# EAGLE design Untitled (EAGLE 7.1.0)
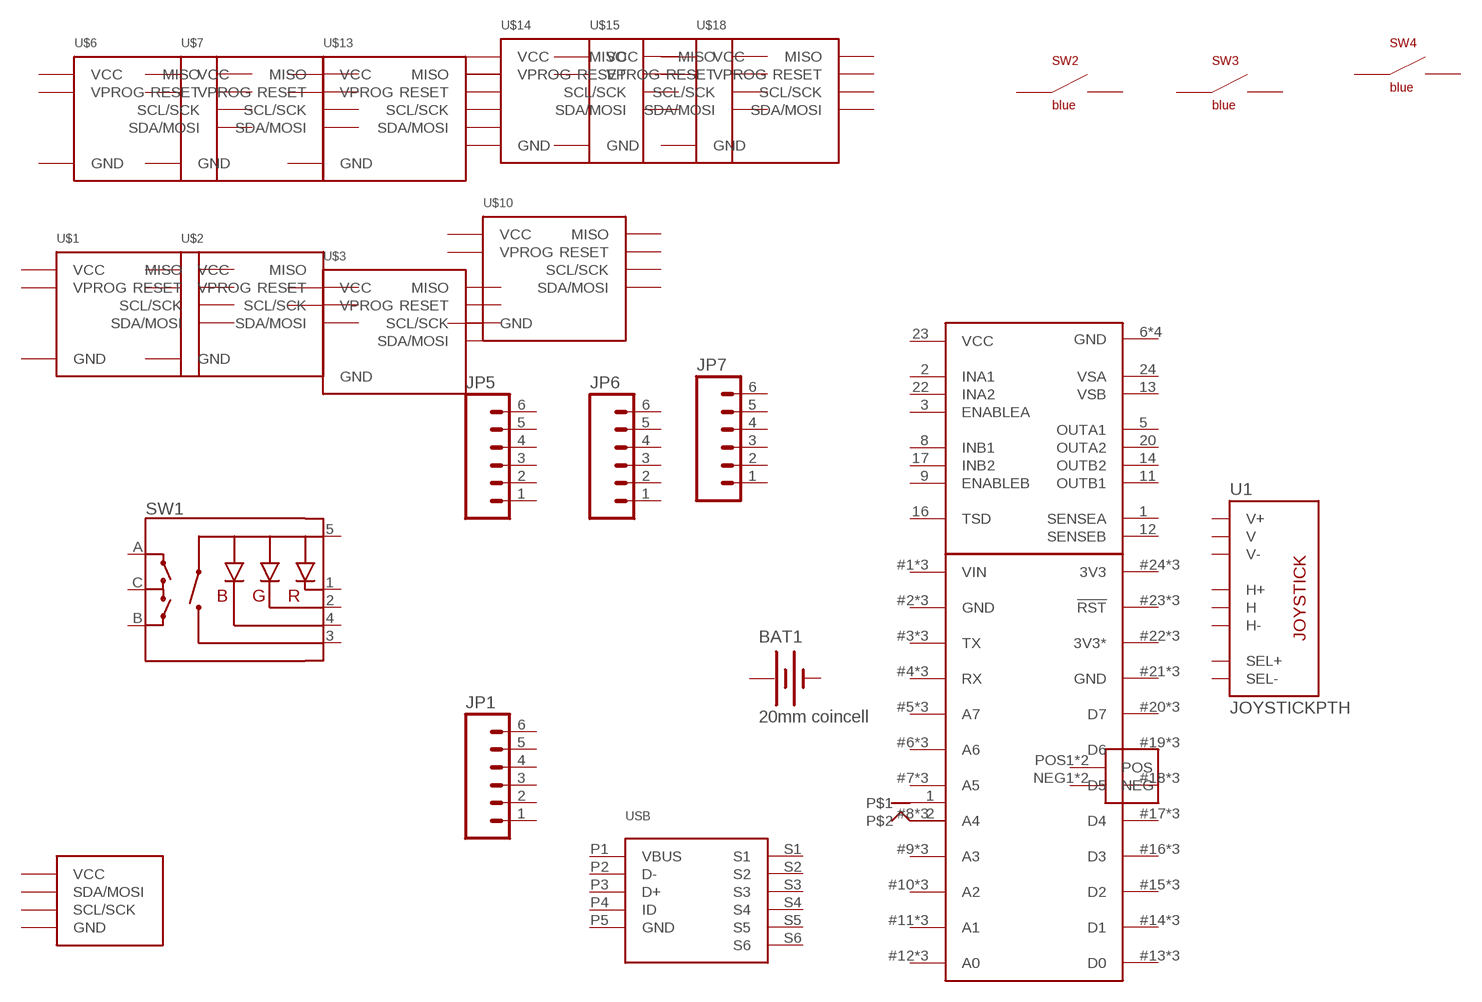
[diagram p0: schematic, sheet 1]

## Parts
BAT1  20mm coincell  BATTERY20MM_4LEGS  [BATTCON_20MM_4LEGS]
JP1  M06SIP  [1X06]
JP5  M06SIP  [1X06]
JP6  M06SIP  [1X06]
JP7  M06SIP  [1X06]
SW1  ENCODER_RGB_CA  [ENCODER_LED_3]
SW2  blue  SWITCHBOURNS-7914J  [BOURNS-7914J]
SW3  blue  SWITCHBOURNS-7914J  [BOURNS-7914J]
SW4  blue  SWITCHBOURNS-7914J  [BOURNS-7914J]
U1  JOYSTICKPTH  [JOYSTICK]
U$1  MAGDEVICE-V2  [MAGDEVICE-V2]
U$2  MAGDEVICE-V2  [MAGDEVICE-V2]
U$3  MAGDEVICE-V2  [MAGDEVICE-V2]
U$4  SPARK_CORE  [SPARK_CORE_STACKABLE]
U$5  DC-JACKLOWPRO  [DC-POWER-JACK-LOWPRO]
U$6  MAGDEVICE-V2  [MAGDEVICE-V2]
U$7  MAGDEVICE-V2  [MAGDEVICE-V2]
U$8  NJM2670  [SOP-24-E3]
U$9  THERMOCOUPLE-JACK  [THERMOCOUPLE-JACK]
U$10  MAGDEVICE-V2  [MAGDEVICE-V2]
U$11  MAGBASE  [MAGBASE]
U$13  MAGDEVICE-V2  [MAGDEVICE-V2]
U$14  MAGDEVICE-V2  [MAGDEVICE-V2]
U$15  MAGDEVICE-V2  [MAGDEVICE-V2]
U$16  USBFCI-MICROB  [USB-MICROB-FCI]
U$18  MAGDEVICE-V2  [MAGDEVICE-V2]
Unconnected: JP1.1 JP1.2 JP1.3 JP1.4 JP1.5 JP1.6 JP5.1 JP5.2 JP5.3 JP5.4 JP5.5 JP5.6 JP6.1 JP6.2 JP6.3 JP6.4 JP6.5 JP6.6 JP7.1 JP7.2 JP7.3 JP7.4 JP7.5 JP7.6 SW1.1(-R) SW1.2(-G) SW1.3(SW) SW1.4(-B) SW1.5(+) SW1.A SW1.B SW1.C SW2.NEG$1(NEG1) SW2.NEG$2(NEG1) SW2.POS$1(POS1) SW2.POS$2(POS1) SW3.NEG$1(NEG1) SW3.NEG$2(NEG1) SW3.POS$1(POS1) SW3.POS$2(POS1) SW4.NEG$1(NEG1) SW4.NEG$2(NEG1) SW4.POS$1(POS1) SW4.POS$2(POS1) U1.B1A(SEL+) U1.B2A(SEL-) U1.H1(H+) U1.H2(H) U1.H3(H-) U1.V1(V+) U1.V2(V) U1.V3(V-) U$1.GND(SDA/MOSI) U$1.MISO U$1.RESET U$1.SCL(GND) U$1.SDA(SCL/SCK) U$1.VCC U$1.VPROG U$2.GND(SDA/MOSI) U$2.MISO U$2.RESET U$2.SCL(GND) U$2.SDA(SCL/SCK) U$2.VCC U$2.VPROG U$3.GND(SDA/MOSI) U$3.MISO U$3.RESET U$3.SCL(GND) U$3.SDA(SCL/SCK) U$3.VCC U$3.VPROG U$4.3(TX) U$4.4(RX) U$4.5(A7) U$4.6(A6) U$4.7(A5) U$4.8(A4) U$4.9(A3) U$4.10(A2) U$4.11(A1) U$4.12(A0) U$4.13(D0) U$4.14(D1) U$4.15(D2) U$4.16(D3) U$4.17(D4) U$4.18(D5) U$4.19(D6) U$4.20(D7) U$4.23(!RST) U$4.#3(TX) U$4.#4(RX) U$4.#5(A7) U$4.#6(A6) U$4.#7(A5) U$4.#8(A4) U$4.#9(A3) U$4.#10(A2) U$4.#11(A1) U$4.#12(A0) U$4.#13(D0) U$4.#14(D1) U$4.#15(D2) U$4.#16(D3) U$4.#17(D4) U$4.#18(D5) U$4.#19(D6) U$4.#20(D7) U$4.#23(!RST) U$4.@3(TX) U$4.@4(RX) U$4.@5(A7) U$4.@6(A6) U$4.@7(A5) U$4.@8(A4) U$4.@9(A3) U$4.@10(A2) U$4.@11(A1) U$4.@12(A0) U$4.@13(D0) U$4.@14(D1) U$4.@15(D2) U$4.@16(D3) U$4.@17(D4) U$4.@18(D5) U$4.@19(D6) U$4.@20(D7) U$4.@23(!RST) U$5.1 U$5.2 U$6.GND(SDA/MOSI) U$6.MISO U$6.RESET U$6.SCL(GND) U$6.SDA(SCL/SCK) U$6.VCC U$6.VPROG U$7.GND(SDA/MOSI) U$7.MISO U$7.RESET U$7.SCL(GND) U$7.SDA(SCL/SCK) U$7.VCC U$7.VPROG U$8.1(SENSEA) U$8.2(INA1) U$8.3(ENABLEA) U$8.5(OUTA1) U$8.6(GND) U$8.7(GND) U$8.8(INB1) U$8.9(ENABLEB) U$8.11(OUTB1) U$8.12(SENSEB) U$8.13(VSB) U$8.14(OUTB2) U$8.16(TSD) U$8.17(INB2) U$8.18(GND) U$8.19(GND) U$8.20(OUTA2) U$8.22(INA2) U$8.23(VCC) U$8.24(VSA) U$9.NEG1(NEG) U$9.NEG2(NEG) U$9.POS1(POS) U$9.POS2(POS) U$10.GND(SDA/MOSI) U$10.MISO U$10.RESET U$10.SCL(GND) U$10.SDA(SCL/SCK) U$10.VCC U$10.VPROG U$11.GNDA(GND) U$11.GNDB(GND) U$11.SCLA(SCL/SCK) U$11.SCLB(SCL/SCK) U$11.SDAA(SDA/MOSI) U$11.SDAB(SDA/MOSI) U$11.VCCA(VCC) U$11.VCCB(VCC) U$13.GND(SDA/MOSI) U$13.MISO U$13.RESET U$13.SCL(GND) U$13.SDA(SCL/SCK) U$13.VCC U$13.VPROG U$14.GND(SDA/MOSI) U$14.MISO U$14.RESET U$14.SCL(GND) U$14.SDA(SCL/SCK) U$14.VCC U$14.VPROG U$15.GND(SDA/MOSI) U$15.MISO U$15.RESET U$15.SCL(GND) U$15.SDA(SCL/SCK) U$15.VCC U$15.VPROG U$16.P1(VBUS) U$16.P2(D-) U$16.P3(D+) U$16.P4(ID) U$16.P5(GND) U$16.S1 U$16.S2 U$16.S3 U$16.S4 U$16.S5 U$16.S6 U$18.GND(SDA/MOSI) U$18.MISO U$18.RESET U$18.SCL(GND) U$18.SDA(SCL/SCK) U$18.VCC U$18.VPROG

## Power pins joined to a net without a drawn wire
3V3: U$4.24(3V3) U$4.#24(3V3) U$4.@24(3V3)
3V3*: U$4.22(3V3*) U$4.#22(3V3*) U$4.@22(3V3*)
+: BAT1.1(+)
-: BAT1.2(-)
GND: U$4.2(GND) U$4.21(GND) U$4.#2(GND) U$4.#21(GND) U$4.@2(GND) U$4.@21(GND)
VIN: U$4.1(VIN) U$4.#1(VIN) U$4.@1(VIN)

## Library data of the parts
BAT1 = SparkFun-Electromechanical:BATTERY: Battery Holders Various common sizes : AA, AAA, 20mm coin cell and 12mm coin cell. 20MM_4LEGS, BATT-10373; PROD_ID: BATT-10373
JP1 JP5-JP7 = SparkFun-Connectors:M06: Header 6 Standard 6-pin 0.1" header. Use with straight break away headers (SKU : PRT-00116), right angle break away headers (PRT-00553), swiss pins (PRT-00743), machine pins (PRT-00117), and female headers (PRT-00115). Molex polarized connector foot print use with SKU : PRT-08094 with associated crimp pins and housings. NOTES ON THE VARIANTS LOCK and LOCK_LONGPADS... This footprint was designed to help hold the alignment of a through-hole component (i.e. 6-pin header) while soldering it into place. You may notice that each hole has been shifted either up or down by 0.005 of an inch from it's more standard position (which is a perfectly straight line). This slight alteration caused the pins (the squares in the middle) to touch the edges of the holes. Because they are alternating, it causes a "brace" to hold the component in place. 0.005 has proven to be the perfect amount of "off-center" position when using our standard breakaway headers. Although looks a little odd when you look at the bare footprint, once you have a header in there, the alteration is very hard to notice. Also,if you push a header all the way into place, it is covered up entirely on the bottom side. This idea of altering the position of holes to aid alignment will be further integrated into the Sparkfun Library for other footprints. It can help hold any component with 3 or more connection pins.
SW1 = SparkFun-Electromechanical:ENCODER_RGB_CA: Illuminated Rotary Encoder w/ RGB LED and select switch EC12PLRGBSDVBF-D: http://top-up.so-buy.com/front/bin/ptdetail.phtml?Part=EC12PLRGBSDVBF-D
SW2-SW4 = Modulo:SWITCH; PARTNUM: 7914J-1-000E
U1 = IntegerLabs:JOYSTICK: Thumb Joystick Joystick commonly found in PS2 controllers. Two pots and a select switch. Footprint proven. Spark Fun Electronics SKU : COM-09032
U$1-U$3 U$6 U$7 U$10 U$13-U$15 U$18 = Modulo:MAGDEVICE
U$4 = Spark:SPARK_CORE
U$5 = IntegerLabs:DC-JACK
U$8 = IntegerLabs:NJM2670
U$9 = IntegerLabs:THERMOCOUPLE-JACK
U$11 = Modulo:MAGBASE; PARTNUM: EXCLUDE
U$16 = IntegerLabs:USB

## Board
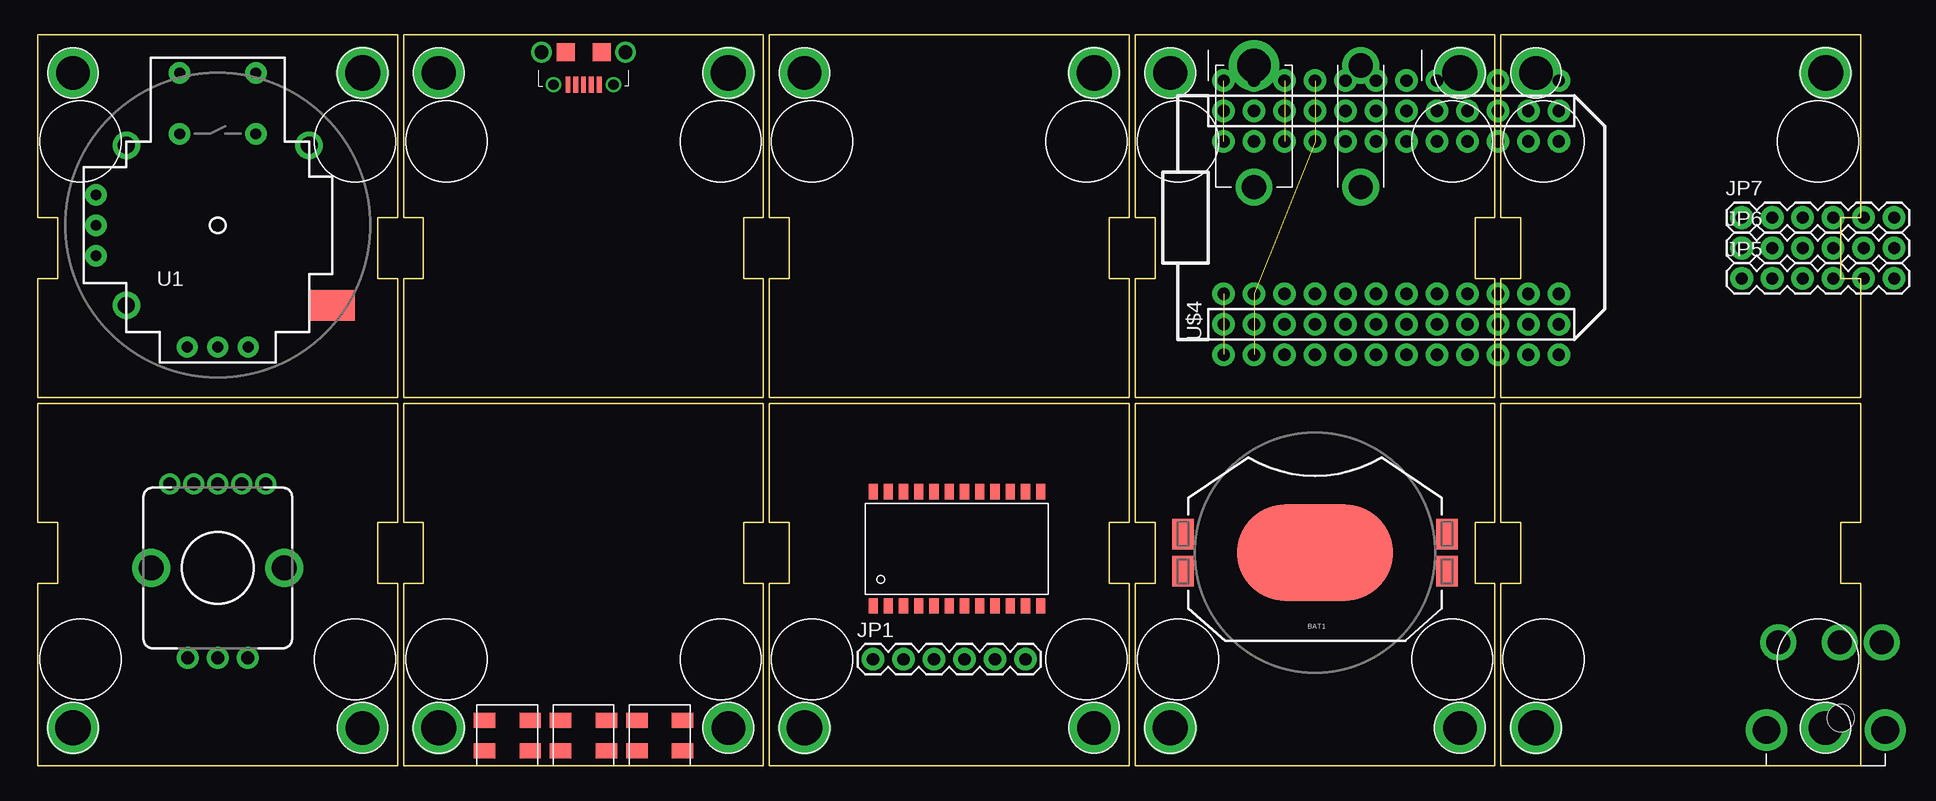
[diagram p1: board, top side]
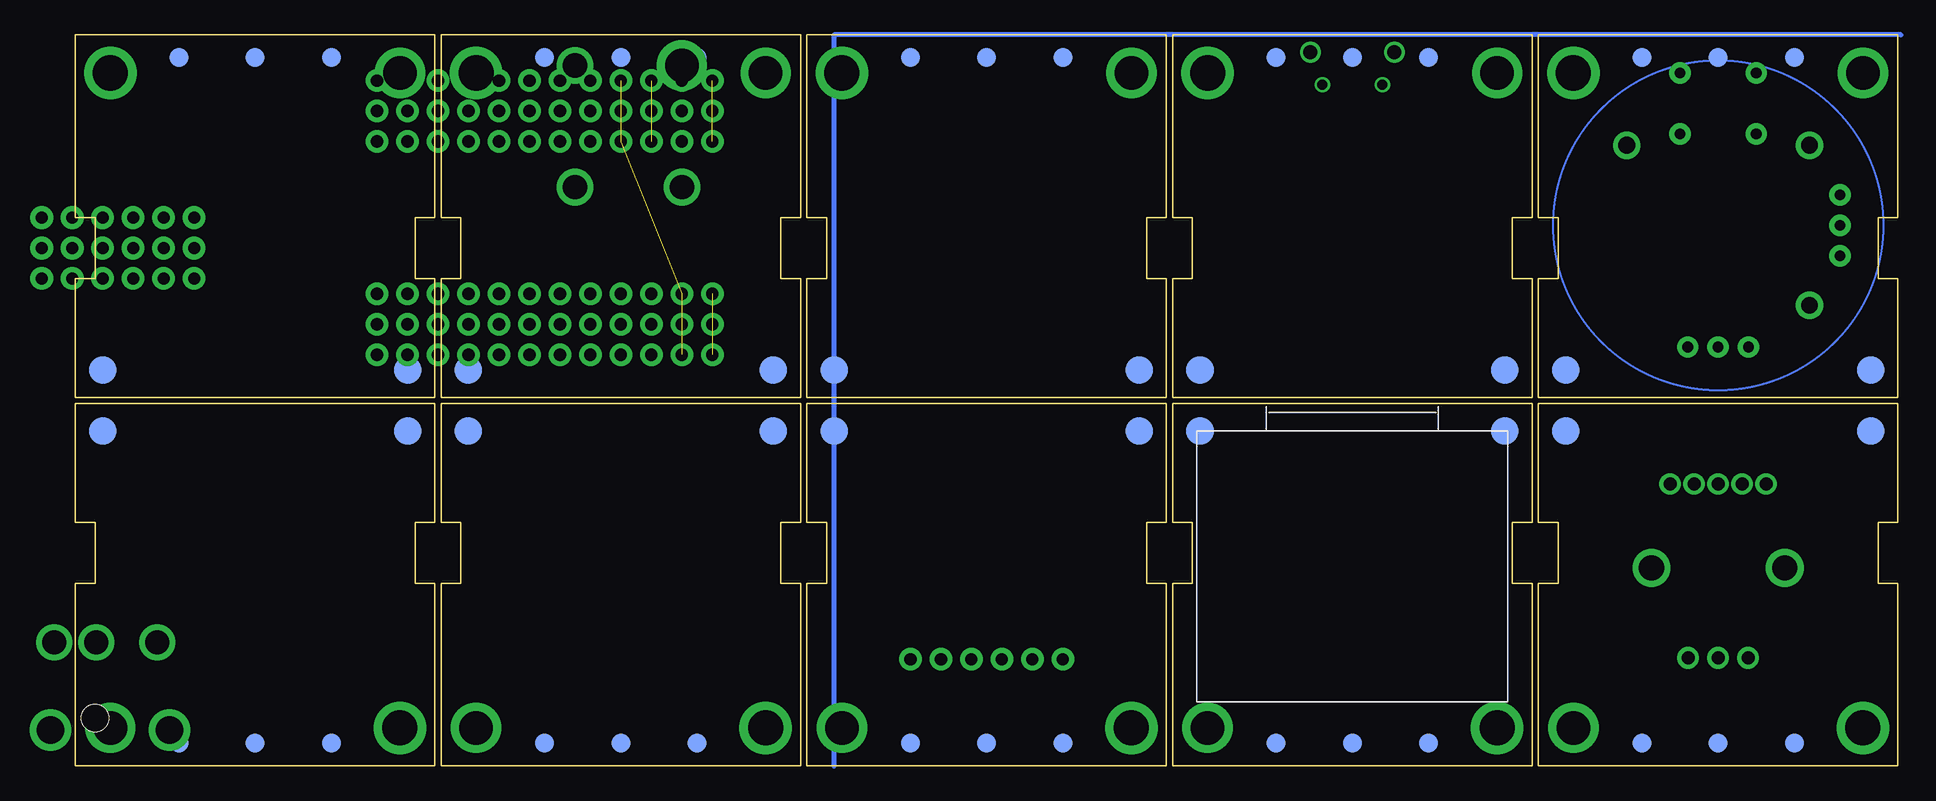
[diagram p2: board, bottom side, seen from below]

Size 151.89 x 60.96 mm. Coordinates in mm from the lower left corner, seen from the top.
Copper layers (1*16): Top 0.0178mm / dielectric 59mil / Bottom 0.0178mm
Design rules "SSC-EAGLE-2Lyr_v1.0.0.3": minimum track width 6mil, minimum drill 14mil, track to track 6mil, track to pad 6mil, pad to pad 6mil, via to via 6mil, smd to smd 6mil, copper to edge 20mil, drill to drill 16mil, minimum pad ring 8mil, minimum via ring 8mil, stop-mask expansion 3mil, vias tented up to drill 0mil, thermal gap 10mil

### Footprints (pad centres in the part's own frame; a part is rotated, then mirrored left to right if it is on the bottom)
BATTCON_20MM_4LEGS = smd 1.778 x 2.54: 1 -11,1.55; 3 11,1.55; P$1 -11,-1.55; P$2 11,-1.55 | smd 13 x 8: 2 0,0
1X06 = drill 1.016 pad 1.88: 1 0,0; 2 2.54,0; 3 5.08,0; 4 7.62,0; 5 10.16,0; 6 12.7,0
ENCODER_LED_3 = drill 1.1 pad 1.778: 1 -4,7; 2 -2,7; 3 0,7; 4 2,7; 5 4,7 | drill 1.1 pad 1.8: A -2.5,-7.5; B 2.5,-7.5; C 0,-7.5 | drill 2.1: M1 -5.55,0; M2 5.55,0
BOURNS-7914J = smd 1.27 x 1.778: NEG$1 1.27,1.905; NEG$2 1.27,-1.905; POS$1 -1.27,1.905; POS$2 -1.27,-1.905
JOYSTICK = drill 0.9 pad 1.778: B1A -3.175,12.7; B1B 3.175,12.7; B2A -3.175,7.62; B2B 3.175,7.62 | drill 0.889 pad 1.778: H1 -2.54,-10.16; H2 0,-10.16; H3 2.54,-10.16; V1 -10.16,2.54; V2 -10.16,0; V3 -10.16,-2.54 | drill 1.397 pad 2.286: MOUNT1 -7.62,6.668; MOUNT2 -7.62,-6.668; MOUNT4 7.62,6.668 | smd 3.81 x 2.54: MOUNT3 9.525,-6.668
MAGDEVICE-V2 = smd 2.286 x 2.286 bottom: GND 2.54,27.94; VCC 27.94,27.94 | smd 1.587 x 1.587 bottom: MISO 8.89,1.905; RESET 21.59,1.905; VPROG 15.24,1.905 | drill 2.794: SCL 27.305,3.175 | drill 2.921: SDA 3.175,3.175
SPARK_CORE_STACKABLE = drill 1.016 pad 1.88: 1 -8.89,13.97; 2 -8.89,11.43; 3 -8.89,8.89; 4 -8.89,6.35; 5 -8.89,3.81; 6 -8.89,1.27; 7 -8.89,-1.27; 8 -8.89,-3.81; 9 -8.89,-6.35; 10 -8.89,-8.89; 11 -8.89,-11.43; 12 -8.89,-13.97; 13 8.89,-13.97; 14 8.89,-11.43; 15 8.89,-8.89; 16 8.89,-6.35; 17 8.89,-3.81; 18 8.89,-1.27; 19 8.89,1.27; 20 8.89,3.81; 21 8.89,6.35; 22 8.89,8.89; 23 8.89,11.43; 24 8.89,13.97; #1 -6.35,13.97; #2 -6.35,11.43; #3 -6.35,8.89; #4 -6.35,6.35; #5 -6.35,3.81; #6 -6.35,1.27; #7 -6.35,-1.27; #8 -6.35,-3.81; #9 -6.35,-6.35; #10 -6.35,-8.89; #11 -6.35,-11.43; #12 -6.35,-13.97; #13 11.43,-13.97; #14 11.43,-11.43; #15 11.43,-8.89; #16 11.43,-6.35; #17 11.43,-3.81; #18 11.43,-1.27; #19 11.43,1.27; #20 11.43,3.81; #21 11.43,6.35; #22 11.43,8.89; #23 11.43,11.43; #24 11.43,13.97; @1 -11.43,13.97; @2 -11.43,11.43; @3 -11.43,8.89; @4 -11.43,6.35; @5 -11.43,3.81; @6 -11.43,1.27; @7 -11.43,-1.27; @8 -11.43,-3.81; @9 -11.43,-6.35; @10 -11.43,-8.89; @11 -11.43,-11.43; @12 -11.43,-13.97; @13 6.35,-13.97; @14 6.35,-11.43; @15 6.35,-8.89; @16 6.35,-6.35; @17 6.35,-3.81; @18 6.35,-1.27; @19 6.35,1.27; @20 6.35,3.81; @21 6.35,6.35; @22 6.35,8.89; @23 6.35,11.43; @24 6.35,13.97
DC-POWER-JACK-LOWPRO = drill 2: 1 10.3,-3.4; 2 10.3,5.2; 3 10.3,0.1 | drill 2.3: S1 3,6.2; S2 3,-3.7 | hole 2.26: 4,0
SOP-24-E3 = smd 0.762 x 1.27: 1 -6.35,-4.445; 2 -5.08,-4.445; 3 -3.81,-4.445; 4 -2.54,-4.445; 5 -1.27,-4.445; 6 0,-4.445; 7 1.27,-4.445; 8 2.54,-4.445; 9 3.81,-4.445; 10 5.08,-4.445; 11 6.35,-4.445; 12 7.62,-4.445; 13 7.62,5.08; 14 6.35,5.08; 15 5.08,5.08; 16 3.81,5.08; 17 2.54,5.08; 18 1.27,5.08; 19 0,5.08; 20 -1.27,5.08; 21 -2.54,5.08; 22 -3.81,5.08; 23 -5.08,5.08; 24 -6.35,5.08
THERMOCOUPLE-JACK = drill 2.032: NEG1 8.89,10.16; POS1 0,0; POS2 0,10.16 | drill 2.794: NEG2 8.89,0
MAGBASE = smd 1.587 x 1.587: GNDA 5.715,31.115; SCLA 28.575,5.715; SDAA 1.905,5.715; VCCA 28.575,27.305 | drill 1.016: GNDB 8.255,31.115; SCLB 28.575,8.255; SDAB 1.905,8.255; VCCB 28.575,24.765 | hole 4.064: 27.94,16.51; 2.54,16.51 | hole 3.683: 2.54,21.59; 27.94,11.43 | hole 3.302: 2.54,11.43; 27.94,21.59
USB-MICROB-FCI = smd 0.4 x 1.35: P1 -1.3,2.7; P2 -0.65,2.7; P3 0,2.7; P4 0.65,2.7; P5 1.3,2.7 | drill 0.85: S1 -2.5,2.7; S2 2.5,2.7 | drill 1.15: S3 -3.5,0; S6 3.5,0 | smd 1.5 x 1.5: S4 -1.5,0; S5 1.5,0

### Placement (x,y rotation side)
BAT1  106.43,17.78 180 top
JP1  69.6,8.89 0 top
JP5  141.99,40.64 0 top
JP6  141.99,43.18 0 top
JP7  141.99,45.72 0 top
SW1  14.99,16.51 0 top
SW2  39.12,2.54 270 top
SW3  51.82,2.54 90 top
SW4  45.47,2.54 90 top
U1  14.99,45.09 0 top
U$1  121.67,0 0 top
U$2  91.19,0 0 top
U$3  91.19,60.96 180 top
U$4  112.78,45.72 90 top
U$5  150.24,0 90 top
U$6  -0.25,0 0 top
U$7  30.23,0 0 top
U$8  75.95,17.78 0 top
U$9  110.24,58.42 180 top
U$10  121.67,60.96 180 top
U$11  111.51,66.04 0 top  (outside the outline)
U$12  [COLOR-OLED]  45.47,27.94 180 top
U$13  60.71,0 0 top
U$14  152.15,60.96 180 top
U$15  30.23,60.96 180 top
U$16  45.47,59.51 180 top
U$18  60.71,60.96 180 top

### Tracks (layer width: path | path; a pad name or v marks a point on that pad's centre or on a via)
3V3  (2 unrouted)
3V3*  (2 unrouted)
GND  (5 unrouted)
N$6
  Bottom 0.406: 88.65,0 88.65,60.96 -0.25,60.96
VIN  (2 unrouted)
(copper drawn outside any net)
  shapes: Bottom circle x1